# EAGLE design receiver (EAGLE 8.7.0)
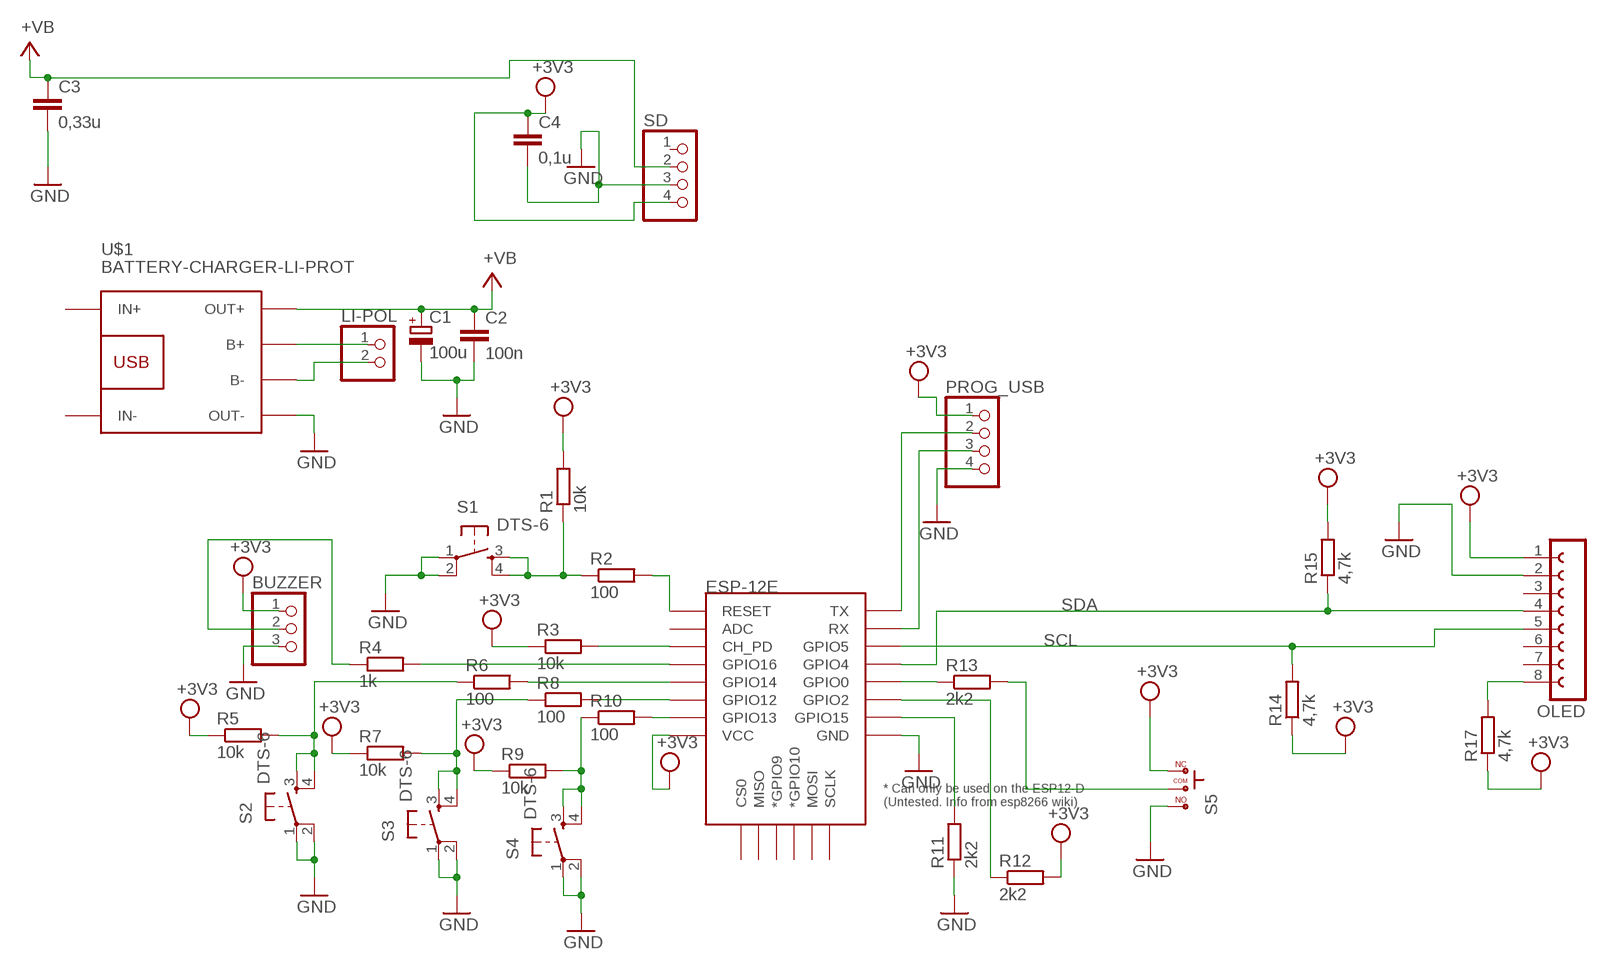
[diagram p0: schematic, sheet 1]

## Parts
BUZZER  PINHD-1X3/90  [1X03/90]
C1  100u  CPOL-EUE2.5-6  [E2,5-6]
C2  100n  C-EU025-025X050  [C025-025X050]
C3  0,33u  C-EU025-025X050  [C025-025X050]
C4  0,1u  C-EU025-025X050  [C025-025X050]
ESP-12E  ESP12ESMD  [ESP12E-SMD]
LI-POL  PINHD-1X2  [1X02]
OLED  FE08-1  [FE08]
PROG_USB  PINHD-1X4  [1X04]
R1  10k  R-EU_0204/7  [0204/7]
R2  100  R-EU_0204/7  [0204/7]
R3  10k  R-EU_0204/7  [0204/7]
R4  1k  R-EU_0204/7  [0204/7]
R5  10k  R-EU_0204/7  [0204/7]
R6  100  R-EU_0204/7  [0204/7]
R7  10k  R-EU_0204/7  [0204/7]
R8  100  R-EU_0204/7  [0204/7]
R9  10k  R-EU_0204/7  [0204/7]
R10  100  R-EU_0204/7  [0204/7]
R11  2k2  R-EU_0204/7  [0204/7]
R12  2k2  R-EU_0204/7  [0204/7]
R13  2k2  R-EU_0204/7  [0204/7]
R14  4,7k  R-EU_0204/7  [0204/7]
R15  4,7k  R-EU_0204/7  [0204/7]
R17  4,7k  R-EU_0204/7  [0204/7]
S1  DTS-6  [DTS-6]
S2  DTS-6  [DTS-6]
S3  DTS-6  [DTS-6]
S4  DTS-6  [DTS-6]
S5  -SWITCH  [CON3]
SD  PINHD-1X4  [1X04]
U$1  BATTERY-CHARGER-LI-PROT  [BATTERY-CHARGER-LI-PROT]

## Nets
GND: BUZZER.3 C1.- C2.2 C3.2 C4.2 ESP-12E.GND OLED.2 PROG_USB.4 R11.1 S1.1 S1.2 S2.1 S2.2 S3.1 S3.2 S4.1 S4.2 S5.P$3 SD.3 U$1.OUT-
N$2: ESP-12E.CH_PD R3.2
N$3: R13.2 S5.P$2
N$4: ESP-12E.GPIO2 R12.1
N$5: ESP-12E.TXD0(TX) PROG_USB.2
N$6: ESP-12E.RXD0(RX) PROG_USB.3
N$7: ESP-12E.GPIO12 R8.2
N$8: OLED.8 R17.2
N$9: LI-POL.1 U$1.B+
N$10: ESP-12E.GPIO13 R10.2
N$11: ESP-12E.GPIO15 R11.2
N$12: ESP-12E.GPIO14 R6.2
N$13: R7.2 R8.1 S3.3 S3.4
N$14: R1.1 R2.1 S1.3 S1.4
N$15: ESP-12E.GPIO16 R4.2
N$16: LI-POL.2 U$1.B-
N$17: ESP-12E.RESET R2.2
N$18: BUZZER.2 R4.1
N$19: ESP-12E.GPIO0 R13.1
N$22: R9.2 R10.1 S4.3 S4.4
N$23: R5.2 R6.1 S2.3 S2.4
SCL: ESP-12E.GPIO5 OLED.5 R14.2
SDA: ESP-12E.GPIO4 OLED.4 R15.1
V+: C1.+ C2.1 C3.1 SD.2 U$1.OUT+ ; supply symbol labelled +VB
VCC: BUZZER.1 C4.1 ESP-12E.VCC OLED.1 PROG_USB.1 R1.2 R3.1 R5.1 R7.1 R9.1 R12.2 R14.1 R15.2 R17.1 S5.P$1 SD.4 ; supply symbol labelled +3V3
Unconnected: ESP-12E.ADC ESP-12E.CS0 ESP-12E.GPIO9(*GPIO9) ESP-12E.GPIO10(*GPIO10) ESP-12E.MISO ESP-12E.MOSI ESP-12E.SCLK OLED.3 OLED.6 OLED.7 SD.1 U$1.IN+ U$1.IN-

## Library data of the parts
BUZZER = pinhead:PINHD-1X3: PIN HEADER
C1 = rcl:CPOL-EU: POLARIZED CAPACITOR, European symbol; SPICEPREFIX: C
C2-C4 = rcl:C-EU: CAPACITOR, European symbol; SPICEPREFIX: C
ESP-12E = esp8266modules:ESP12E: ESP12E Module
LI-POL = pinhead:PINHD-1X2: PIN HEADER
OLED = con-lsta:FE08-1: FEMALE HEADER; OC_FARNELL: unknown; OC_NEWARK: unknown
PROG_USB SD = pinhead:PINHD-1X4: PIN HEADER
R1-R15 R17 = rcl:R-EU_: RESISTOR, European symbol; SPICEPREFIX: R
S1-S4 = switch-tact:DTS-6
S5 = tango:-SWITCH
U$1 = diy-modules:BATTERY-CHARGER-LI-PROT: Lithium Battery 5V Charger with protection circuit More details available here: http://www.instructables.com/id/DIY-Lithium-ion-Battery-Charger/step4/TP4056-based-lithium-ion-battery-charger-module/ Click here to find device on ebay.com <http://www.ebay.com/sch/tp4056+charger+usb+protection>

## Board
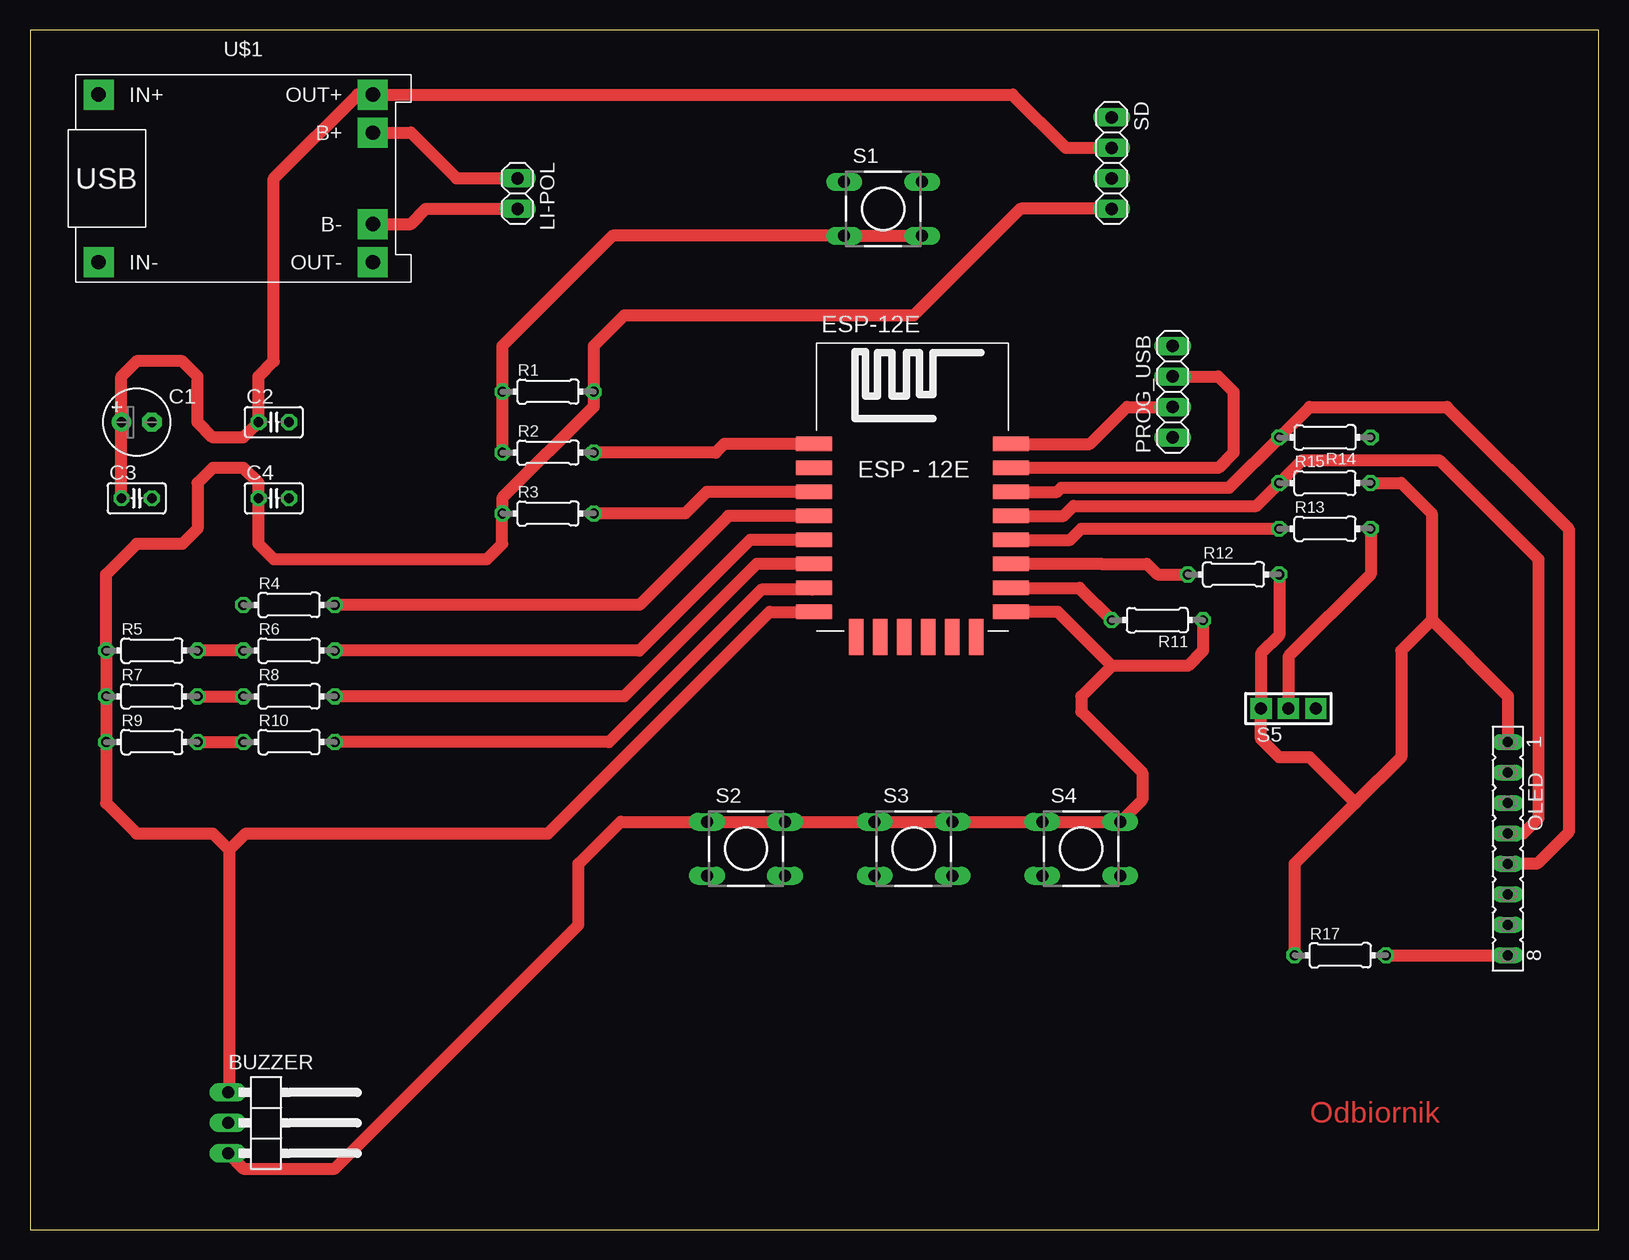
[diagram p1: board, top side]
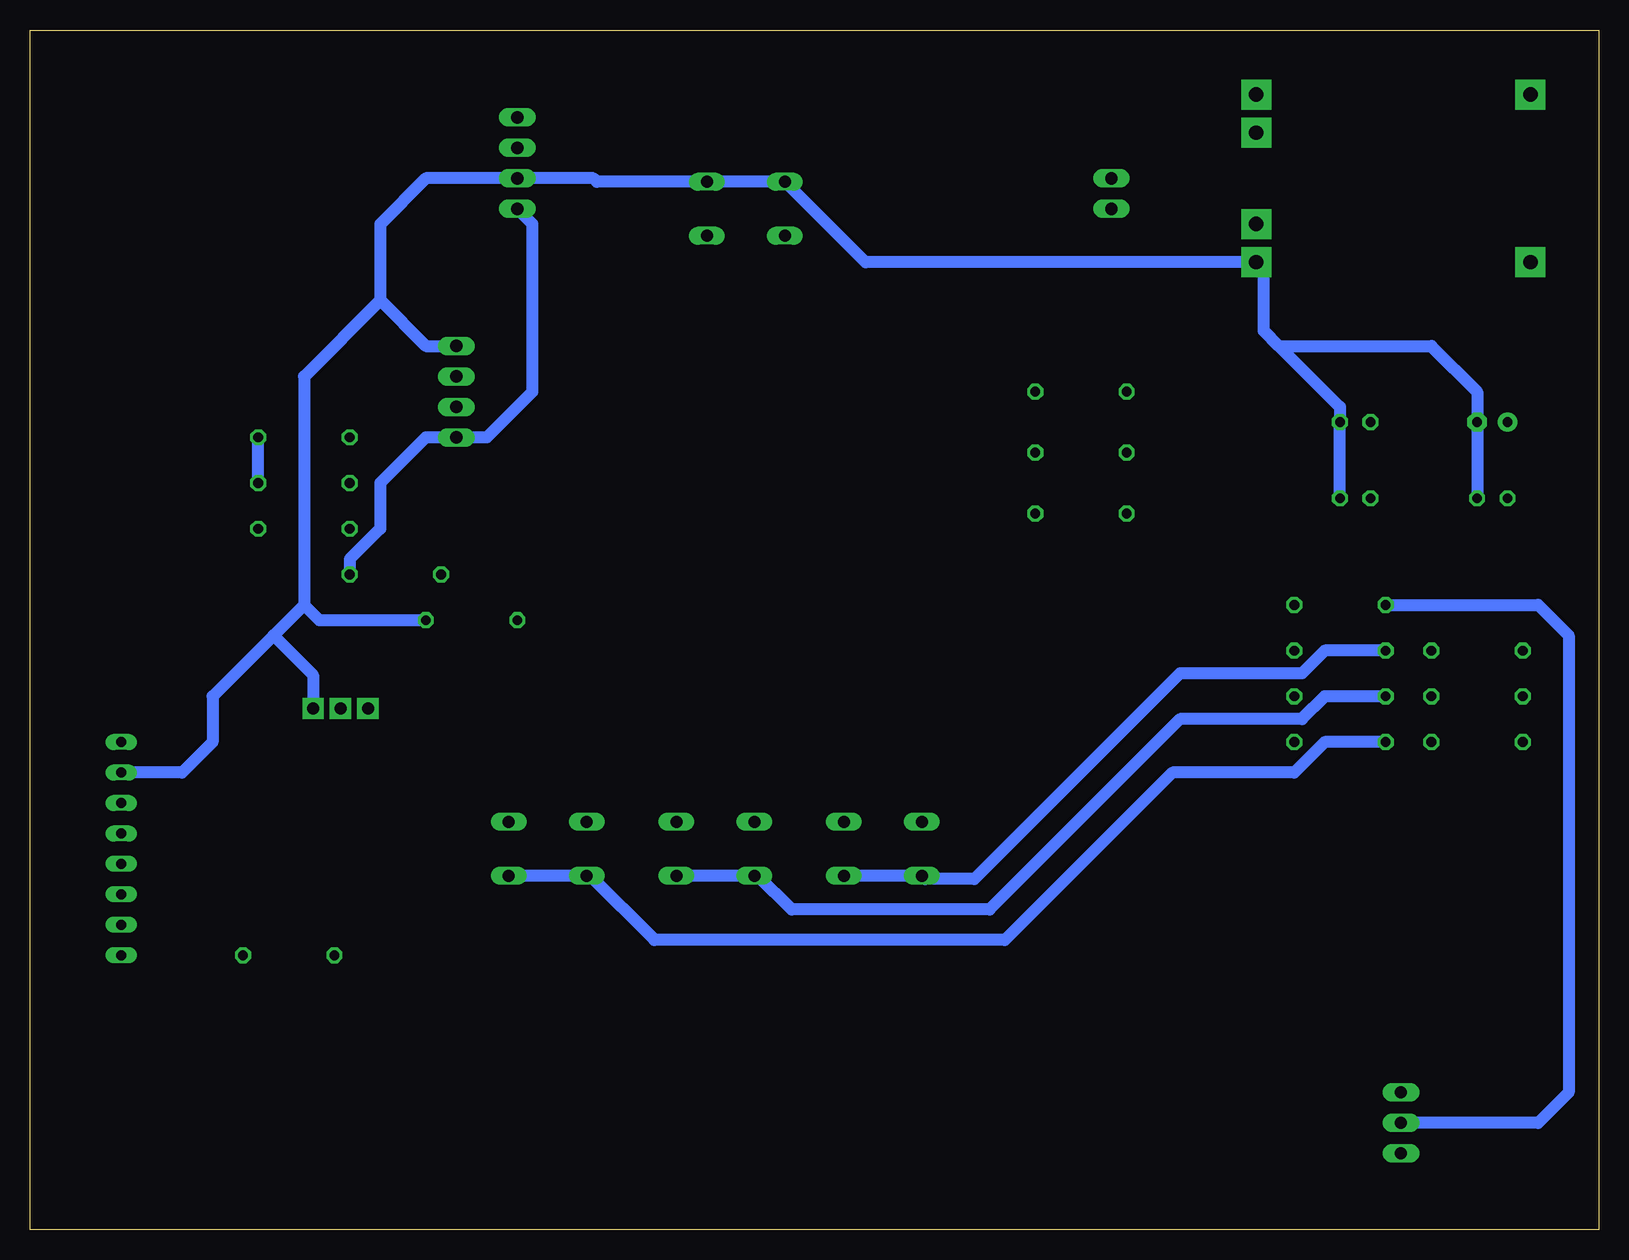
[diagram p2: board, bottom side, seen from below]

Size 130.79 x 100 mm. Coordinates in mm from the lower left corner, seen from the top.
Outline: 0,0 130.79,0 130.79,100 0,100 0,0
Copper layers (1*16): Top 0.035mm / dielectric 1.5mm / Bottom 0.035mm
Design rules "default": minimum track width 6mil, minimum drill 0.35mm, track to track 6mil, track to pad 6mil, pad to pad 6mil, via to via 6mil, smd to smd 6mil, copper to edge 40mil, drill to drill 6mil, minimum pad ring 10mil, minimum via ring 8mil, stop-mask expansion 4mil, vias tented up to drill 0mil, thermal gap 10mil

### Footprints (pad centres in the part's own frame; a part is rotated, then mirrored left to right if it is on the bottom)
1X03/90 = drill 1.016 long: 1 -2.54,-3.81; 2 0,-3.81; 3 2.54,-3.81
E2,5-6 = drill 0.813 pad 1.6: + -1.27,0 | drill 0.813 pad 1.6 octagon: - 1.27,0
C025-025X050 = drill 0.813 octagon: 1 -1.27,0; 2 1.27,0
ESP12E-SMD = smd 3 x 1.2: ADC -8.3,3.8; CH_PD -8.3,1.8; GND 8.1,-8.2; GPIO0 8.1,-2.2; GPIO2 8.1,-4.2; GPIO4 8.1,-0.2; GPIO5 8.1,1.8; GPIO12 -8.3,-4.2; GPIO13 -8.3,-6.2; GPIO14 -8.3,-2.2; GPIO15 8.1,-6.2; GPIO16 -8.3,-0.2; RESET -8.3,5.8; RXD0 8.1,3.8; TXD0 8.1,5.8; VCC -8.3,-8.2 | smd 1.2 x 3: CS0 -4.8,-10.3; GPIO9 -0.8,-10.3; GPIO10 1.2,-10.3; MISO -2.8,-10.3; MOSI 3.2,-10.3; SCLK 5.2,-10.3
1X02 = drill 1.016 long: 1 -1.27,0; 2 1.27,0
FE08 = drill 0.813 long: 1 -8.89,0; 2 -6.35,0; 3 -3.81,0; 4 -1.27,0; 5 1.27,0; 6 3.81,0; 7 6.35,0; 8 8.89,0
1X04 = drill 1.016 long: 1 -3.81,0; 2 -1.27,0; 3 1.27,0; 4 3.81,0
0204/7 = drill 0.813 octagon: 1 -3.81,0; 2 3.81,0
DTS-6 = drill 1 long: 1 -3.25,2.25; 2 3.25,2.25; 3 -3.25,-2.25; 4 3.25,-2.25
CON3 = drill 1 pad 1.778 square: P$1 -2.794,0.254; P$2 -0.508,0.254; P$3 1.778,0.254
BATTERY-CHARGER-LI-PROT = drill 1.2 pad 2.5 square: B+ 10.795,3.81; B- 10.795,-3.81; IN+ -12.065,6.985; IN- -12.065,-6.985; OUT+ 10.795,6.985; OUT- 10.795,-6.985

### Placement (x,y rotation side)
BUZZER  20.32,8.89 270 top
C1  8.89,67.31 0 top
C2  20.32,67.31 0 top
C3  8.89,60.96 0 top
C4  20.32,60.96 0 top
ESP-12E  73.66,59.69 0 top
LI-POL  40.64,86.36 270 top
OLED  123.19,31.75 270 top
PROG_USB  95.25,69.85 90 top
R1  43.18,69.85 0 top
R2  43.18,64.77 0 top
R3  43.18,59.69 0 top
R4  21.59,52.07 0 top
R5  10.16,48.26 0 top
R6  21.59,48.26 0 top
R7  10.16,44.45 0 top
R8  21.59,44.45 0 top
R9  10.16,40.64 0 top
R10  21.59,40.64 0 top
R11  93.98,50.8 180 top
R12  100.33,54.61 0 top
R13  107.95,58.42 0 top
R14  107.95,66.04 180 top
R15  107.95,62.23 0 top
R17  109.22,22.86 0 top
S1  71.12,85.09 0 top
S2  59.69,31.75 0 top
S3  73.66,31.75 0 top
S4  87.63,31.75 0 top
S5  105.41,43.18 0 top
SD  90.17,88.9 270 top
U$1  17.78,87.63 0 top

### Tracks (layer width: path | path; a pad name or v marks a point on that pad's centre or on a via)
GND
  Top 0.991: R11.1 97.79,48.26 96.52,46.99 90.17,46.99 | 90.17,46.99 85.67,51.49 ESP-12E.GND | 90.17,46.99 87.63,44.45 87.63,43.18 92.71,38.1 92.71,35.83 S4.2 S4.1 S3.2 S3.1 S2.2 S2.1 49.24,34 45.72,30.48 45.72,25.4 25.4,5.08 17.78,5.08 BUZZER.3
  Bottom 0.991: 26.67,73.66 27.94,74.93 27.94,80.01 U$1.OUT- 61.14,80.64 67.82,87.33 S1.1 S1.2 83.53,87.34 83.82,87.63 SD.3 97.79,87.63 101.6,83.82 101.6,77.47 | 26.67,73.66 21.59,68.58 C2.2 C4.2 | 26.67,73.66 13.97,73.66 10.16,69.85 C1.- C3.2 | 101.6,77.47 97.79,73.66 PROG_USB.4 | 101.6,77.47 107.95,71.12 107.95,52.07 | 107.95,52.07 106.68,50.8 R11.1 | 107.95,52.07 110.49,49.53 | 110.49,49.53 115.57,44.45 115.57,40.64 118.11,38.1 OLED.2 | 110.49,49.53 107.19,46.23 S5.P$3
N$2
  Top 0.991: 47.09,59.74 R3.2 54.61,59.69 56.41,61.49 ESP-12E.CH_PD
N$3
  Top 0.991: R13.2 111.76,54.61 104.9,47.75 S5.P$2
N$4
  Top 0.991: 82.3,55.47 81.84,55.47 ESP-12E.GPIO2 88.9,55.49 89.29,55.49 93.1,55.49 93.98,54.61 R12.1
N$5
  Top 0.991: 81.84,65.53 ESP-12E.TXD0 88.35,65.49 91.44,68.58 PROG_USB.2
N$6
  Top 0.991: ESP-12E.RXD0 99.06,63.5 100.33,64.77 100.33,69.85 99.06,71.12 PROG_USB.3
N$7
  Top 0.991: ESP-12E.GPIO12 60.57,55.49 49.53,44.45 R8.2
N$8
  Top 0.991: R17.2 OLED.8
N$9
  Top 0.991: U$1.B+ 31.75,91.44 35.56,87.63 LI-POL.1
N$10
  Top 0.991: ESP-12E.GPIO13 65.21,53.34 60.96,53.34 48.26,40.64 R10.2
N$11
  Top 0.991: ESP-12E.GPIO15 87.48,53.49 R11.2
N$12
  Top 0.991: ESP-12E.GPIO14 60.03,57.49 50.8,48.26 R6.2
N$13
  Top 0.991: R7.2 R8.1
  Bottom 0.991: R8.1 22.86,44.45 24.77,42.55 34.92,42.55 50.8,26.67 67.31,26.67 70.14,29.5 S3.3 S3.4
N$14
  Top 0.991: R2.1 R1.1 39.37,73.66 48.55,82.84 S1.3 S1.4
N$15
  Top 0.991: R4.2 50.8,52.07 58.22,59.49 ESP-12E.GPIO16
N$16
  Top 0.991: U$1.B- 31.75,83.82 33.02,85.09 LI-POL.2
N$17
  Top 0.991: 65.23,65.38 ESP-12E.RESET 57.87,65.49 57.15,64.77 R2.2
N$18
  Bottom 0.991: R4.1 5.08,52.07 2.54,49.53 2.54,11.43 5.08,8.89 BUZZER.2
N$19
  Top 0.991: ESP-12E.GPIO0 86.7,57.49 87.63,58.42 R13.1
N$22
  Top 0.991: R9.2 R10.1
  Bottom 0.991: R10.1 22.86,40.64 25.4,38.1 35.56,38.1 49.53,24.13 78.74,24.13 84.11,29.5 S4.3 S4.4
N$23
  Top 0.991: R6.1 17.68,48.31 14.02,48.31 R5.2
  Bottom 0.991: R6.1 22.86,48.26 24.77,46.35 34.92,46.35 52.07,29.21 56.15,29.21 S2.3 S2.4
SCL
  Top 0.991: ESP-12E.GPIO5 85.62,61.49 85.98,61.85 99.95,61.85 R14.2 106.68,68.58 118.11,68.58 128.27,58.42 128.27,33.12 125.68,30.53 123.24,30.53 OLED.5
SDA
  Top 0.991: ESP-12E.GPIO4 86.16,59.49 87,60.33 102.23,60.33 R15.1 106.05,64.14 117.47,64.14 125.73,55.88 125.73,34.29 124.46,33.02 OLED.4
V+
  Top 0.991: SD.2 86.36,90.17 81.92,94.61 U$1.OUT+ 27.3,94.61 20.32,87.63 20.32,72.39 19.05,71.12 C2.1 17.78,66.04 15.24,66.04 13.97,67.31 13.97,71.12 12.7,72.39 8.89,72.39 7.62,71.12 C1.+ C3.1
VCC
  Top 0.991: 39.47,59.74 R3.1 | 16.61,31.65 16.61,11.43 BUZZER.1 | 16.61,31.65 15.24,33.02 8.89,33.02 6.35,35.56 R9.1 R7.1 R5.1 6.35,54.61 8.89,57.15 12.7,57.15 13.97,58.42 13.97,62.23 15.24,63.5 17.78,63.5 19.05,62.23 C4.1 19.05,57.15 20.32,55.88 38.1,55.88 39.37,57.15 R3.1 | R3.1 39.37,60.96 46.99,68.58 R1.2 46.99,73.66 49.53,76.2 73.66,76.2 82.55,85.09 SD.4 | 16.61,31.65 17.98,33.02 43.18,33.02 61.65,51.49 ESP-12E.VCC | 116.84,50.8 114.3,48.26 114.3,39.37 110.49,35.56 | 110.49,35.56 105.41,30.48 R17.1 | 116.84,50.8 123.19,44.45 OLED.1 | 110.49,35.56 106.68,39.37 104.14,39.37 102.62,40.89 S5.P$1 102.62,48.01 104.14,49.53 R12.2 | R15.2 114.3,62.23 116.84,59.69 116.84,50.8
  Bottom 0.152: PROG_USB.1 96.52,66.04
  Bottom 0.991: R12.2 104.14,55.88 101.6,58.42 101.6,62.23 97.79,66.04 PROG_USB.1 92.71,66.04 88.9,69.85 88.9,83.82 SD.4 | R15.2 R14.1

### Text on the board
Top: Odbiornik